# EAGLE design periph-tester (EAGLE 7.5.0)
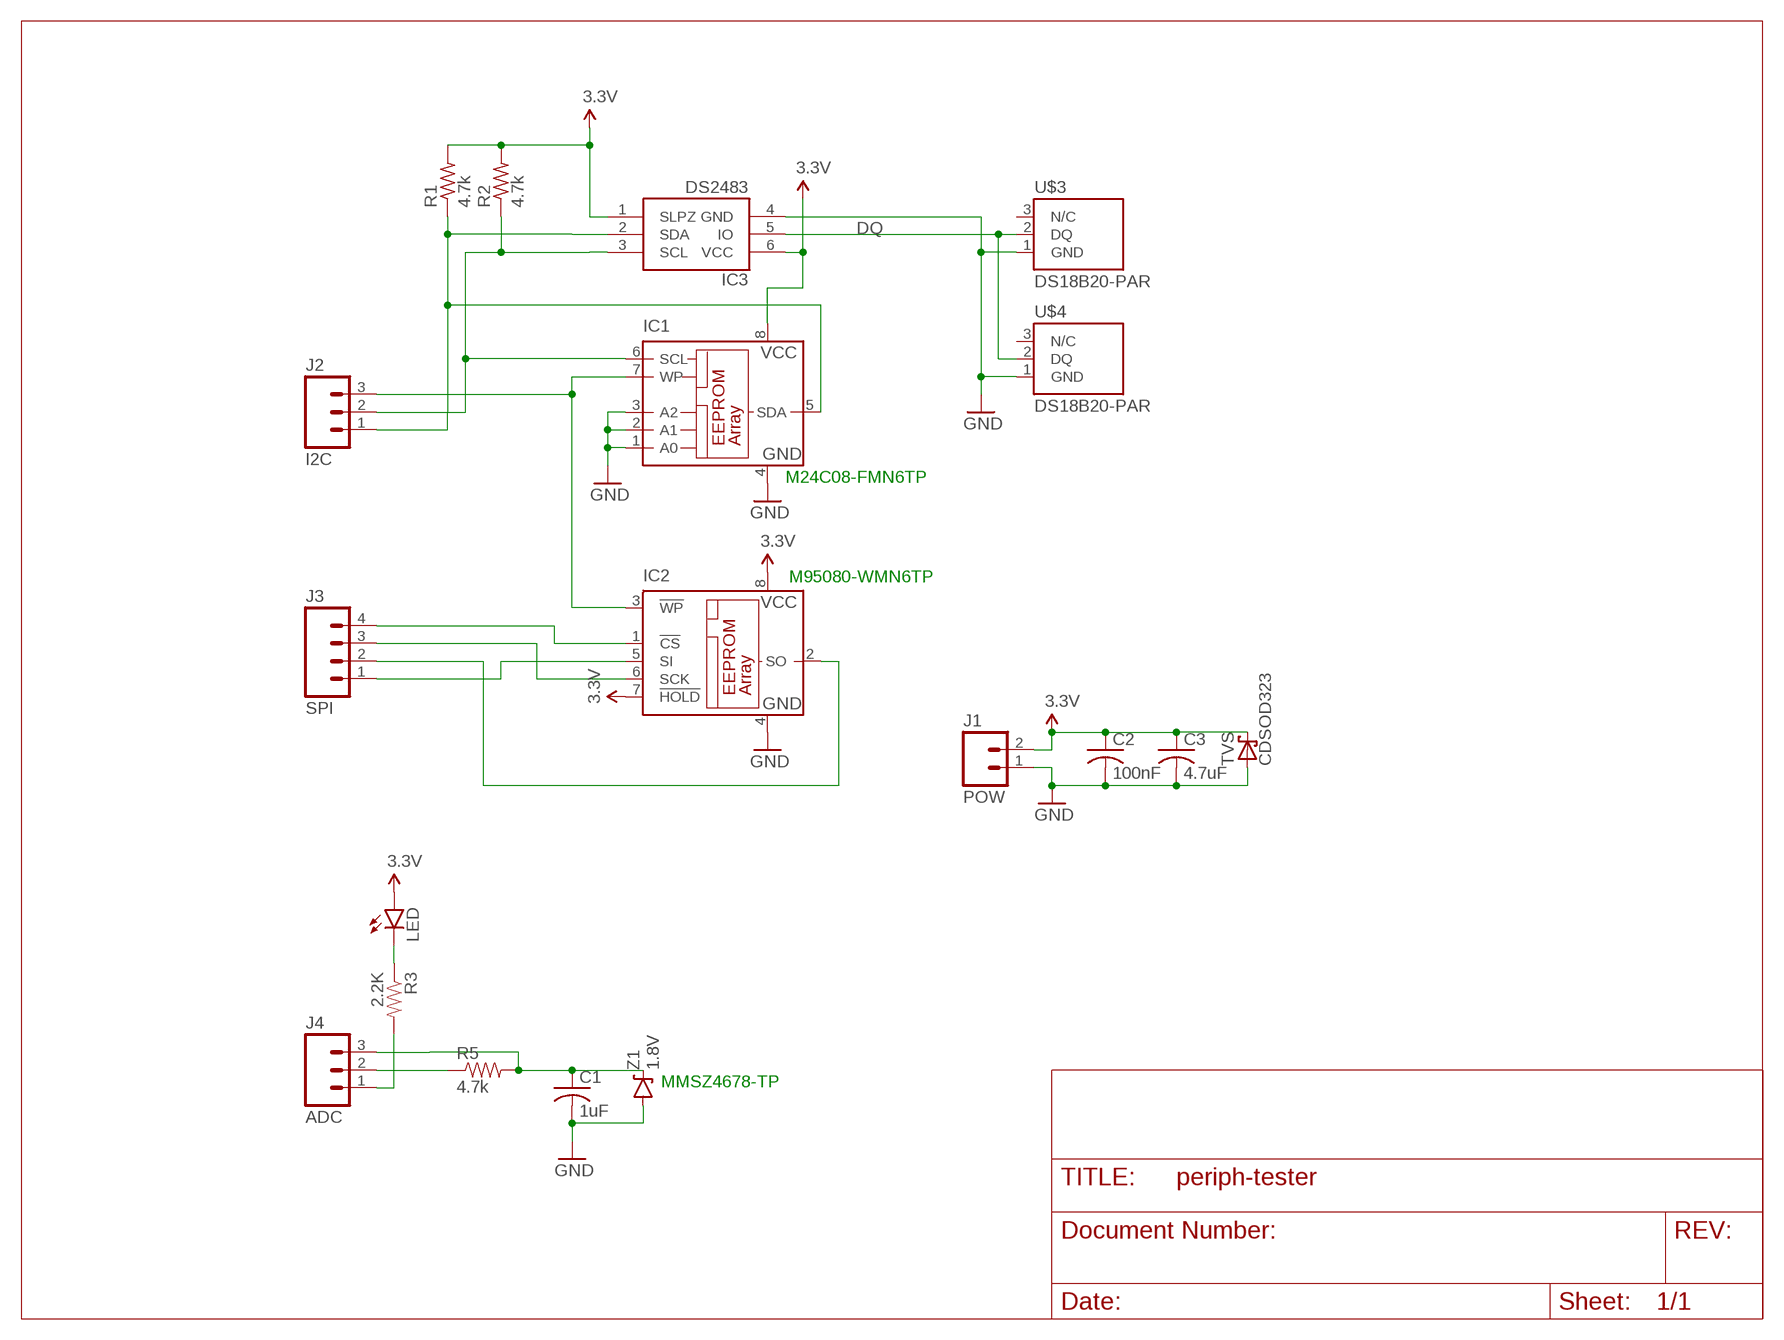
[diagram p0: schematic, sheet 1]

## Parts
C1  1uF  C-USC0603K  [C0603K]
C2  100nF  C-USC0603K  [C0603K]
C3  4.7uF  C-USC0805K  [C0805K]
IC1  24C04SN  [SO-08]
IC2  25C080SN  [SO-08]
IC3  DS2483  [SOT23-6]
J1  POW  M02PTH  [1X02]
J2  I2C  M03PTH  [1X03]
J3  SPI  M04PTH  [1X04]
J4  ADC  M03PTH  [1X03]
LED  LED0603  [LED-0603]
R1  4.7k  R-US_R0603  [R0603]
R2  4.7k  R-US_R0603  [R0603]
R3  2.2K  RESISTOR0603-RES  [0603-RES]
R5  4.7k  RESISTOR0603-RES  [0603-RES]
TVS  CDSOD323  [SOD323-W]
U$3  DS18B20-PAR  [TO-92]
U$4  DS18B20-PAR  [TO-92]
Z1  1.8V  DIODE-ZENER16V  [SOD-123]

## Nets
3.3V [power]: C2.1 C3.1 IC1.8(VCC) IC2.7(!HOLD) IC2.8(VCC) IC3.1(SLPZ) IC3.6(VCC) J1.2 LED.A R1.2 R2.2 TVS.C
DQ: IC3.5(IO) U$3.2(DQ) U$4.2(DQ)
GND [power]: C1.2 C2.2 C3.2 IC1.1(A0) IC1.2(A1) IC1.3(A2) IC1.4(GND) IC2.4(GND) IC3.4(GND) J1.1 TVS.A U$3.1(GND) U$4.1(GND) Z1.A
N$1: IC1.6(SCL) IC3.3(SCL) J2.2 R2.1
N$2: LED.C R3.1
N$3: IC1.5(SDA) IC3.2(SDA) J2.1 R1.1
N$4: IC2.5(SI) J3.1
N$5: IC2.6(SCK) J3.3
N$6: IC2.2(SO) J3.2
N$7: IC2.1(!CS) J3.4
N$8: J4.1 R3.2
N$9: IC1.7(WP) IC2.3(!WP) J2.3
N$10: J4.2 R5.1
N$11: C1.1 J4.3 R5.2 Z1.C
Unconnected: U$3.3(N/C) U$4.3(N/C)

## Notes on the sheet
- M24C08-FMN6TP
- M95080-WMN6TP
- MMSZ4678-TP

## Library data of the parts
C1-C3 = resistor:C-US: CAPACITOR, American symbol
IC1 = tve-parts:24C*: Serial EEPROM 1 K/2 K/4 K; MPN: M24C04-WMN6P; OC_FARNELL: 9882812; OC_NEWARK: 83K1376
IC2 = tve-parts:25*: Serial EEPROM 4K/ 8K , SPI bus; MF: MICROCHIP; MPN: 25C080/SN; OC_FARNELL: unknown; OC_NEWARK: 96K4086
IC3 = tve-parts:DS2483
J1 = SparkFun-Connectors:M02: Standard 2-pin 0.1" header. Use with - straight break away headers ( PRT-00116) - right angle break away headers (PRT-00553) - swiss pins (PRT-00743) - machine pins (PRT-00117) - female headers (PRT-00115) Molex polarized connector foot print use with: PRT-08233 with associated crimp pins and housings. 2.54_SCREWTERM for use with PRT-10571. 3.5mm Screw Terminal footprints for PRT-08084 5mm Screw Terminal footprints for use with PRT-08432
J2 J4 = SparkFun-Connectors:M03: Header 3 Standard 3-pin 0.1" header. Use with straight break away headers (SKU : PRT-00116), right angle break away headers (PRT-00553), swiss pins (PRT-00743), machine pins (PRT-00117), and female headers (PRT-00115). Molex polarized connector foot print use with SKU : PRT-08232 with associated crimp pins and housings.
J3 = SparkFun-Connectors:M04: Header 4 Standard 4-pin 0.1" header. Use with straight break away headers (SKU : PRT-00116), right angle break away headers (PRT-00553), swiss pins (PRT-00743), machine pins (PRT-00117), and female headers (PRT-00115). Molex polarized connector foot print use with SKU : PRT-08231 with associated crimp pins and housings. 1MM SMD Version SKU: PRT-10208; PROD_ID: CONN-09696
LED = SparkFun-LED:LED: LEDs Standard schematic elements and footprints for 5mm, 3mm, 1206, and 0603 sized LEDs. 5mm - Spark Fun Electronics SKU : COM-00529 (and others)
R1 R2 = resistor:R-US_: RESISTOR, American symbol
R3 R5 = SparkFun-Passives:RESISTOR: Resistor Basic schematic elements and footprints for 0603, 1206, and PTH resistors.
TVS = tve-parts:CDSOD323: TVS DIODE 3.3VWM 10.9VC SMD
U$3 U$4 = tve-parts:DS18B20-PAR: TO-92 temp sensor
Z1 = SparkFun-DiscreteSemi:DIODE-ZENER: Zener Diode Production Part - 8199 3.4V Zener Voltage; PROD_ID: DIO-12440; VALUE: 16V

## Net classes
1 power: width 0.305 mm

## Board
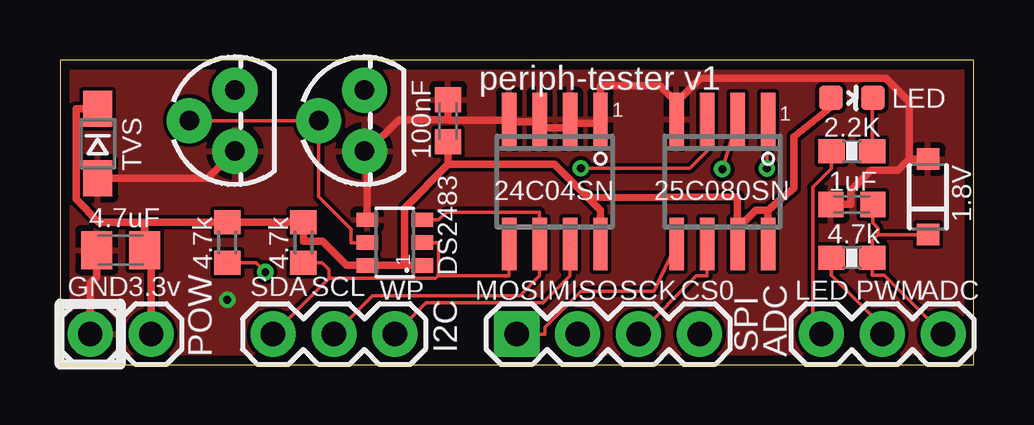
[diagram p1: board, top side]
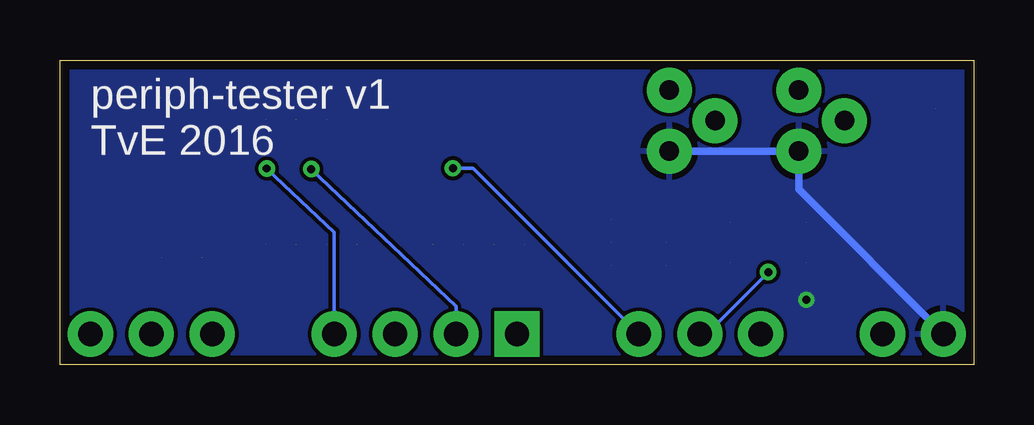
[diagram p2: board, bottom side, seen from below]

Size 38.09 x 12.69 mm. Coordinates in mm from the lower left corner, seen from the top.
Outline: 38.09,0 38.09,12.69 0,12.69 0,0 38.09,0
Copper layers (1*16): Top 0.0356mm / dielectric 1.5011mm / Bottom 0.0356mm
Design rules "OSHpark *": minimum track width 6mil, minimum drill 13mil, track to track 6mil, track to pad 6mil, pad to pad 6mil, via to via 6mil, smd to smd 6mil, copper to edge 15mil, drill to drill 6mil, minimum pad ring 7mil, minimum via ring 7mil, stop-mask expansion 3mil, vias tented up to drill 30mil, thermal gap 10mil

### Footprints (pad centres in the part's own frame; a part is rotated, then mirrored left to right if it is on the bottom)
C0603K = smd 1.05 x 1.08: 1 -0.875,0; 2 0.875,0
C0805K = smd 1.3 x 1.6: 1 -1,0; 2 1,0
SO-08 = smd 0.6 x 2.2: 1 -1.905,-2.6; 2 -0.635,-2.6; 3 0.635,-2.6; 4 1.905,-2.6; 5 1.905,2.6; 6 0.635,2.6; 7 -0.635,2.6; 8 -1.905,2.6
SOT23-6 = smd 0.6 x 0.9: 1 -0.95,-1.15; 2 0,-1.15; 3 0.95,-1.15; 4 0.95,1.15; 5 0,1.15; 6 -0.95,1.15
1X02 = drill 1.016 pad 1.88: 1 0,0; 2 2.54,0
1X03 = drill 1.016 pad 1.88: 1 0,0; 2 2.54,0; 3 5.08,0
1X04 = drill 1.016 pad 1.88 square: 1 0,0 | drill 1.016 pad 1.88: 2 2.54,0; 3 5.08,0; 4 7.62,0
LED-0603 = smd 1 x 1: A 0,-0.877; C 0,0.877
R0603 = smd 1 x 1.1: 1 -0.85,0; 2 0.85,0
0603-RES = smd 1.1 x 1: 1 -0.85,0; 2 0.85,0
SOD323-W = smd 1.5 x 1.2: A 1.45,0; C -1.45,0
TO-92 = drill 0.813 pad 1.88: 1 -1.27,0; 2 0,1.905; 3 1.27,0
SOD-123 = smd 0.9 x 0.95: A 1.575,0; C -1.575,0

### Placement (x,y rotation side)
C1  33.01,6.67 180 top
C2  16.18,10.16 90 top
C3  2.53,4.76 180 top
IC1  20.63,7.62 180 top
IC2  27.61,7.62 180 top
IC3  13.96,5.08 90 top
J1  1.26,1.27 0 top
J2  8.88,1.27 0 top
J3  19.04,1.27 0 top
J4  31.74,1.27 0 top
LED  33.01,11.11 270 top
R1  10.15,5.08 90 top
R2  6.98,5.08 90 top
R3  33.01,8.89 180 top
R5  33.01,4.45 0 top
TVS  1.58,9.21 270 top
U$3  12.69,10.16 90 top
U$4  7.29,10.16 90 top
Z1  36.19,6.99 90 top

### Tracks (layer width: path | path; a pad name or v marks a point on that pad's centre or on a via)
3.3V  (9 unrouted)
  Top 0.305: 3.53,5.93 R2.2 R1.2 10.15,5.12 10.96,5.12 11.95,4.13 IC3.6 14.36,4.13 | 29.52,6.42 30.59,7.34 30.59,9.49 32.13,10.71 LED.A | 28.25,5.67 29.01,6.42 29.52,6.42 | IC1.8 22.53,6.42 22.01,6.94 | 16.18,8.34 20.62,8.34 22.01,6.94 | 16.18,8.34 14.36,6.51 14.36,4.13 | 16.18,8.34 16.18,8.46 C2.1 | IC2.8 29.52,6.42 | IC2.7 28.25,5.67 | IC3.1 14.36,4.13 | 3.53,5.93 1.62,5.93 0.67,6.88 0.67,10.66 TVS.C | 3.53,5.93 3.53,5.87 3.53,5.32 | 3.53,5.32 3.8,5.04 J1.2 | C3.1 3.53,5.32 | 28.25,5.67 28.25,6.99 22.01,6.94
DQ  (1 unrouted)
  Top 0.152: IC3.5 12.13,5.08 12.13,5.63 10.79,6.98 U$3.2 U$4.2
GND  (via drill 0.33 pad 0.69)
  Top 0.305: 12.81,8.89 IC3.4 | U$3.1 12.81,8.89 | 12.81,8.89 14.12,10.21 16.18,10.21 | C2.2 16.18,10.21 | 18.72,10.17 16.22,10.17 16.18,10.21 | 18.72,10.17 18.72,10.12 19.99,10.12 | IC1.4 18.72,10.17 | 25.71,10.92 26.71,11.92 34.42,11.92 35.41,10.94 35.41,8.56 | 25.71,10.92 25,11.62 22.53,11.62 IC1.1 22.36,10.04 21.26,10.04 | C1.2 32.97,6.67 32.97,7.25 33.8,8.09 34.93,8.09 35.41,8.56 | Z1.A 35.41,8.56 | 21.26,10.04 21.26,9.87 20.24,9.87 19.99,10.12 | IC1.2 21.26,10.04 | IC2.4 25.71,10.92 | IC1.3 19.99,10.12 | C3.2 1.53,3.66 1.26,3.39 J1.1 | U$4.1 6.16,7.76 TVS.A
  Bottom 0.305: J1.1 7.29,7.3 U$4.1 U$3.1
  other vias: 6.98,2.7
  pour Top: -0.01,0 -0.01,13.97 38.09,13.97 38.09,0
  pour Bottom: -0.01,0 -0.01,12.7 39.36,12.7 39.36,0
N$1  (via drill 0.33 pad 0.69)  (3 unrouted)
  Top 0.152: J2.2 13.03,2.88 19.18,2.88 19.99,3.69 IC1.6 19.99,6.35 16.11,6.35 15.79,6.03 IC3.3 | R2.1 8.19,4.23 v8.56,3.85
  Bottom 0.152: v8.56,3.85 11.14,1.27 J2.2
N$2  (2 unrouted)
  Top 0.152: R3.1 33.86,11.09 LED.C
N$3  (3 unrouted)
  Top 0.152: 11.21,3.6 15.65,3.6 15.79,3.73 | J2.1 11.21,3.6 | 11.21,3.6 11.21,3.95 10.93,4.23 R1.1 | 15.79,3.73 15.79,5.08 IC3.2 | 15.79,3.73 15.83,3.69 18.72,3.69 IC1.5
N$4  (1 unrouted)
  Top 0.152: IC2.5 24.75,3.06 21.71,3.06 20.21,1.55 20.21,1.27 J3.1
N$5  (1 unrouted)
  Top 0.152: IC2.6 26.98,3.69 26.54,3.69 J3.3
N$6  (via drill 0.33 pad 0.69)  (1 unrouted)
  Top 0.152: v27.61,8.14 IC2.2
  Bottom 0.152: J3.2 21.58,2.43 v27.61,8.14
N$7  (via drill 0.33 pad 0.69)  (1 unrouted)
  Top 0.152: IC2.1 29.52,8.89 29.47,8.68 v29.47,8.17
  Bottom 0.152: J3.4 26.66,5.52 v29.47,8.17
N$8  (1 unrouted)
  Top 0.152: R3.2 32.16,8.16 31.38,7.38 31.38,1.63 J4.1
N$9  (via drill 0.33 pad 0.69)  (2 unrouted)
  Top 0.152: IC2.3 26.98,8.89 26.26,8.18 v21.71,8.18 | IC1.7 21.26,3.69 20.14,2.57 15.26,2.57 J2.3
  Bottom 0.152: J2.3 20.87,8.18 v21.71,8.18
N$10  (1 unrouted)
  Top 0.152: R5.1 32.16,3.72 34.28,1.6 J4.2
N$11  (1 unrouted)
  Top 0.152: 34.1,5.41 33.86,5.17 R5.2 33.86,3.72 34.37,3.72 J4.3 | Z1.C 34.1,5.41 | 34.1,5.41 34.1,5.69 33.89,5.9 C1.1

### Text on the board
tNames: periph-tester v1 | 1 | 1 | 1 | GND | 3.3v | SDA | SCL | WP | MOSI | MISO | SCK | CS0 | LED | PWM | ADC
bNames: periph-tester v1 / TvE 2016